# Altium schematic sheet Level_Translation.SchDoc: Schematic Sheet Test Title
size 289 x 193 mm; Organization: CXQ; Address1: RM 7401, 550 Jumen Rd, Huangpu District, Shanghai, China; Address2: Huangpu District; Address3: Shanghai; Address4: China; Revision: MB0004-01.A.1; SheetNumber: 1; SheetTotal: 99; PageSetup: Record=PageOptions|CenterHorizontal=True|CenterVertical=True|PrintScale=0.98|XCorrection=1.00|YCorrection=1.00|PrintKind=0|BorderSize=5000000|LeftOffset=0|BottomOffset=0|Orientation=2|PaperLength=1000|PaperWidth=1000|Scale=100|PaperSource=7|PrintQuality=-4|MediaType=1|DitherType=10|PaperKind=A4|PrintScaleMode=1; ProjectName: Project Name
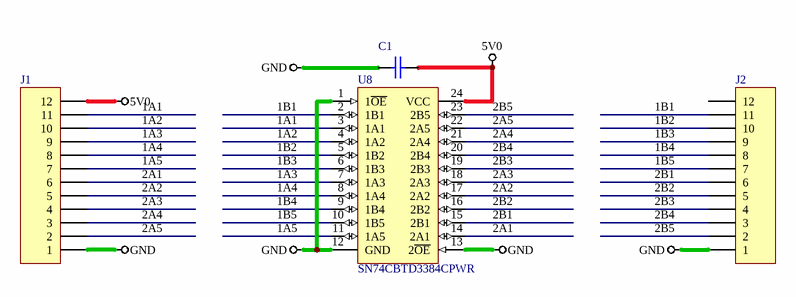
[diagram p0: Level_Translation.SchDoc]

## Parts
C1  CAP 100nF 16V 0805(2012)  [CAPC0805(2012)100_L]  (value not drawn)
J1  Header 12  [HDR1X12]  (value not drawn)
J2  Header 12  [HDR1X12]  (value not drawn)
U8  SN74CBTD3384CPWR  [TSOP65P620X120-24N]

## Nets
5V0: C1.2 J1.12 U8.24(VCC)
GND: C1.1 J1.1 J2.1 U8.1(1~{OE}) U8.12(GND) U8.13(2~{OE})
1A1: J1.11 U8.3(1A1)
1A2: J1.10 U8.4(1A2)
1A3: J1.9 U8.7(1A3)
1A4: J1.8 U8.8(1A4)
1A5: J1.7 U8.11(1A5)
1B1: J2.11 U8.2(1B1)
1B2: J2.10 U8.5(1B2)
1B3: J2.9 U8.6(1B3)
1B4: J2.8 U8.9(1B4)
1B5: J2.7 U8.10(1B5)
2A1: J1.6 U8.14(2A1)
2A2: J1.5 U8.17(2A2)
2A3: J1.4 U8.18(2A3)
2A4: J1.3 U8.21(2A4)
2A5: J1.2 U8.22(2A5)
2B1: J2.6 U8.15(2B1)
2B2: J2.5 U8.16(2B2)
2B3: J2.4 U8.19(2B3)
2B4: J2.3 U8.20(2B4)
2B5: J2.2 U8.23(2B5)

Not connected (* = marked no-connect by the designer): J2 12

## Notes on the sheet
- A4
- DOCUMENT
- DATE
- TIME
- of
- SHEET
- ADDR
- FILE
- RM 7401, 550 Jumen Road
- Huangpu District, Shanghai, China
- www.mesheven.com

## Library data of the parts
C1 = CMP-1036-04400-1: CAP 100nF 16V Â±5% 0805 (2012 Metric) Thickness 1mm SMD; Case-EIA: 0805; Case-Metric: 2012; Max Thickness: 1 mm; Value: 100nF; Tolerance: Â±5%; Technology: SMT; Rated Voltage: 16 V
J1 J2 = Header 12: Header, 12-Pin; LatestRevisionDate: 17-Jul-2002; LatestRevisionNote: Re-released for DXP Platform.; Publisher: Altium Limited
U8 = SN74CBTD3384CPWR: 10-BIT FET BUS SWITCH WITH LEVEL SHIFTING; Manufacturer: Texas Instruments; Circuit: 10 x 1:1; Independent Circuits: 1; Voltage Supply Source: Single Supply; Voltage - Supply: 4.5 V ~ 5.5 V; Manufacturer Part Number: SN74CBTD3384CPWR; Category: Integrated Circuits (ICs); Supplier: Digi-Key; RoHS: RoHS Compliant; Packaging: Tape & Reel (TR); Type: FET Bus Switch; Current - Output High, Low: -; Operating Temperature: -40°C ~ 85°C; Mounting Type: Surface Mount; Package / Case: 24-TSSOP (0.173", 4.40mm Width); Supplier Device Package: 24-TSSOP; ComponentLink1URL: http://www.ti.com/lit/ds/symlink/sn74cbtd3861.pdf; ComponentLink1Description: http://www.ti.com/lit/ds/symlink/sn74cbtd3861.pdf; Supplier Part Number: 296-6487-2-ND; Manufacturer_PN: SN74CBTD3384CPWR